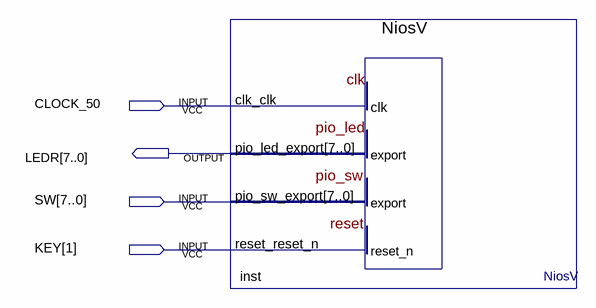
[diagram p0: schematic sheet]
// Quartus schematic NiosV_top.bdf as structural Verilog: 1 symbols, 4 pins
module NiosV_top (
  input  CLOCK_50,
  input  [7:0] SW,
  input  [1:1] KEY,
  output [7:0] LEDR
);

  NiosV inst (.clk_clk(CLOCK_50), .pio_sw_export(SW), .reset_reset_n(KEY[1]), .pio_led_export(LEDR));
endmodule
